# EAGLE design mini-v1.9 (EAGLE 7.2.0)

## Sheet 1 of 4: Main Microcontroller
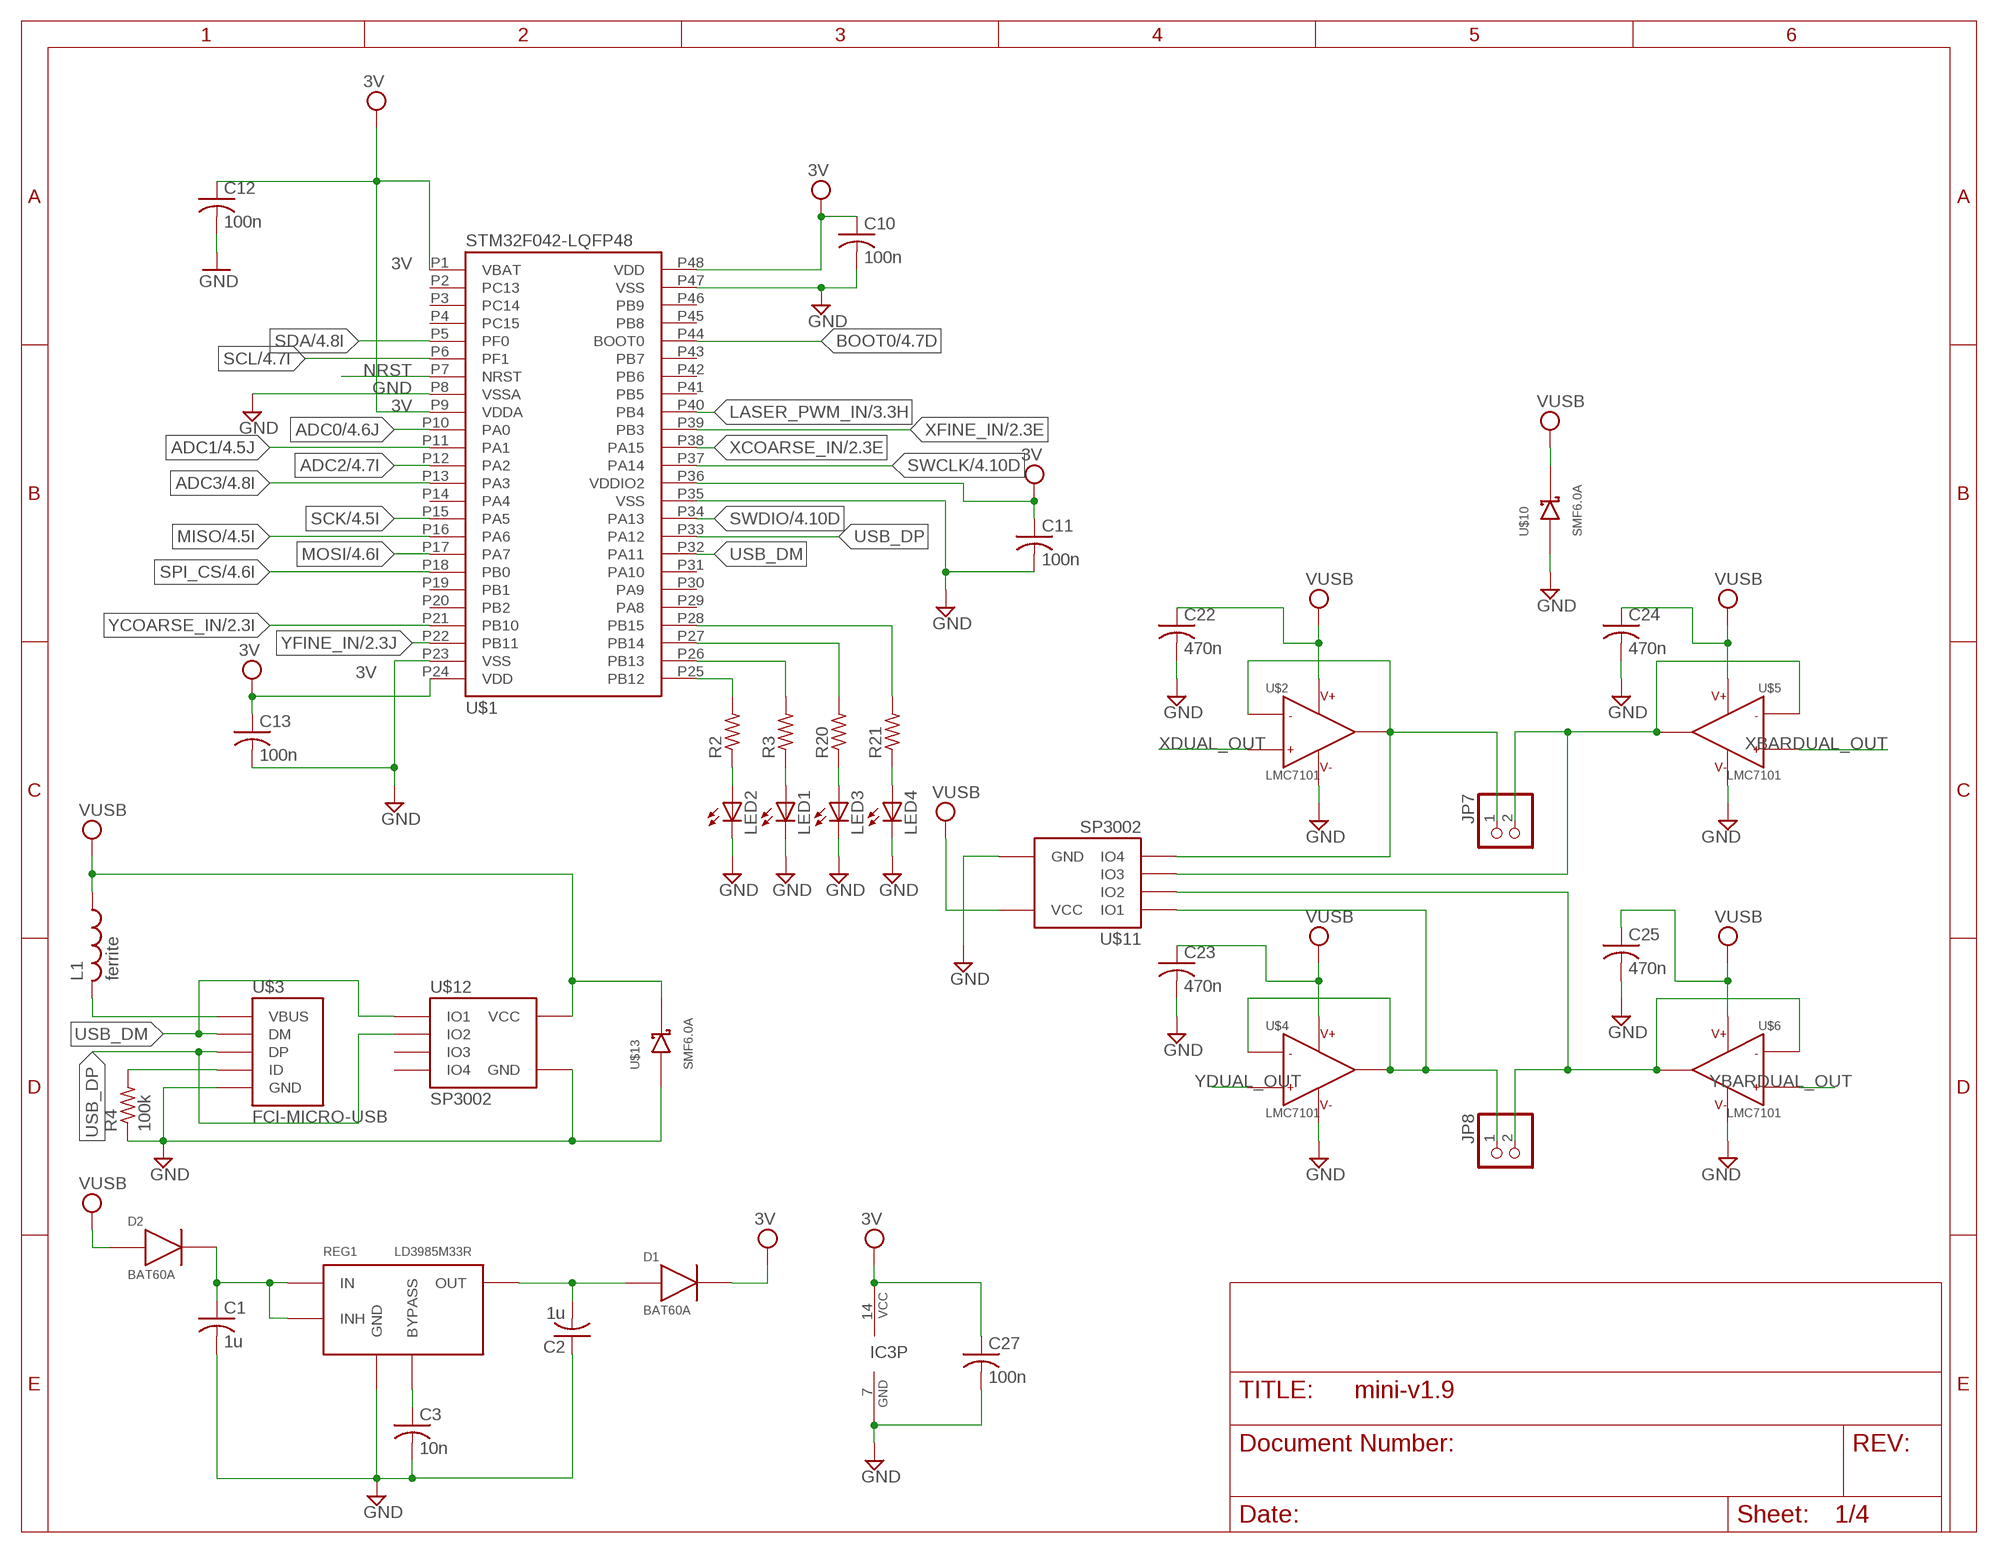
[diagram p0: schematic, sheet 1]

### Parts
C1  1u  C-USC0603  [C0603]
C2  1u  C-USC0603  [C0603]
C3  10n  C-USC0603  [C0603]
C10  100n  C-USC0603  [C0603]
C11  100n  C-USC0603  [C0603]
C12  100n  C-USC0603  [C0603]
C13  100n  C-USC0603  [C0603]
C22  470n  C-USC0603  [C0603]
C23  470n  C-USC0603  [C0603]
C24  470n  C-USC0603  [C0603]
C25  470n  C-USC0603  [C0603]
C27  100n  C-USC0603  [C0603]
D1  BAT60A  [SOD323]
D2  BAT60A  [SOD323]
IC3  74S04D  [SO14]
JP7  PINHD-1X2  [1X02]
JP8  PINHD-1X2  [1X02]
L1  ferrite  L-US  [C0603]
LED1  LEDCHIP-LED0603  [CHIP-LED0603]
LED2  LEDCHIP-LED0603  [CHIP-LED0603]
LED3  LEDCHIP-LED0603  [CHIP-LED0603]
LED4  LEDCHIP-LED0603  [CHIP-LED0603]
R2  R-US_R0603  [R0603]
R3  R-US_R0603  [R0603]
R4  100k  R-US_R0603  [R0603]
R20  R-US_R0603  [R0603]
R21  R-US_R0603  [R0603]
REG1  LD3985M33R  LD3985MXXR  [SOT23-5L]
U$1  STM32F042-LQFP48  [LQFP48]
U$2  LMC7101  [SOT23-5]
U$3  FCI-MICRO-USB  [FCI-MICROUSB]
U$4  LMC7101  [SOT23-5]
U$5  LMC7101  [SOT23-5]
U$6  LMC7101  [SOT23-5]
U$10  SMF6.0A  MBR0520  [SOD123]
U$11  SP3002  [SC70-6]
U$12  SP3002  [SC70-6]
U$13  SMF6.0A  MBR0520  [SOD123]

### Nets
3V: C10.1 C11.1 C12.1 C13.1 C27.1 D1.1 IC3.14(P:VCC) U$1.P1(VBAT) U$1.P9(VDDA) U$1.P24(VDD) U$1.P36(VDDIO2) U$1.P48(VDD) ; also sheet 2,4
3V3: C2.2 D1.2 REG1.OUT
ADC0: U$1.P10(PA0) ; also sheet 4
ADC1: U$1.P11(PA1) ; also sheet 4
ADC2: U$1.P12(PA2) ; also sheet 4
ADC3: U$1.P13(PA3) ; also sheet 4
BOOT0: U$1.P44(BOOT0) ; also sheet 4
GND [Power]: C1.2 C2.1 C3.2 C10.2 C11.2 C12.2 C13.2 C22.2 C23.2 C24.2 C25.2 C27.2 IC3.7(P:GND) LED1.C LED2.C LED3.C LED4.C R4.1 REG1.GND U$1.P8(VSSA) U$1.P23(VSS) U$1.P35(VSS) U$1.P47(VSS) U$2.5 U$3.P5(GND) U$4.5 U$5.5 U$6.5 U$10.ANODE U$11.P2(GND) U$12.P2(GND) U$13.ANODE ; also sheet 2,3,4
LASER_PWM_IN: U$1.P40(PB4) ; also sheet 3
MISO: U$1.P16(PA6) ; also sheet 4
MOSI: U$1.P17(PA7) ; also sheet 4
N$1: C3.1 REG1.BYPASS
N$2: R2.2 U$1.P25(PB12)
N$3: LED2.A R2.1
N$4: C1.1 D2.1 REG1.IN REG1.INHIBIT(INH)
N$5: R4.2 U$3.P4(ID)
N$7: JP7.1 U$2.1 U$2.4 U$11.P6(IO4)
N$9: JP8.1 U$4.1 U$4.4 U$11.P1(IO1)
N$12: LED1.A R3.1
N$13: R3.2 U$1.P26(PB13)
N$14: L1.2 U$3.P1(VBUS)
N$16: JP7.2 U$5.1 U$5.4 U$11.P4(IO3)
N$17: JP8.2 U$6.1 U$6.4 U$11.P3(IO2)
N$24: LED3.A R20.1
N$27: LED4.A R21.1
N$28: R20.2 U$1.P27(PB14)
N$29: R21.2 U$1.P28(PB15)
NRST: U$1.P7(NRST) ; also sheet 4
SCK: U$1.P15(PA5) ; also sheet 4
SCL: U$1.P6(PF1) ; also sheet 4
SDA: U$1.P5(PF0) ; also sheet 4
SPI_CS: U$1.P18(PB0) ; also sheet 4
SWCLK: U$1.P37(PA14) ; also sheet 4
SWDIO: U$1.P34(PA13) ; also sheet 4
USB_DM: U$1.P32(PA11) U$3.P2(DM) U$12.P1(IO1)
USB_DP: U$1.P33(PA12) U$3.P3(DP) U$12.P3(IO2)
VUSB [Power]: C22.1 C23.1 C24.1 C25.1 D2.2 L1.1 U$2.2 U$4.2 U$5.2 U$6.2 U$10.CATHODE U$11.P5(VCC) U$12.P5(VCC) U$13.CATHODE ; also sheet 3
XBARDUAL_OUT: U$5.3 ; also sheet 2
XCOARSE_IN: U$1.P38(PA15) ; also sheet 2
XDUAL_OUT: U$2.3 ; also sheet 2
XFINE_IN: U$1.P39(PB3) ; also sheet 2
YBARDUAL_OUT: U$6.3 ; also sheet 2
YCOARSE_IN: U$1.P21(PB10) ; also sheet 2
YDUAL_OUT: U$4.3 ; also sheet 2
YFINE_IN: U$1.P22(PB11) ; also sheet 2
Unconnected: U$1.P2(PC13) U$1.P3(PC14) U$1.P4(PC15) U$1.P14(PA4) U$1.P19(PB1) U$1.P20(PB2) U$1.P29(PA8) U$1.P30(PA9) U$1.P31(PA10) U$1.P41(PB5) U$1.P42(PB6) U$1.P43(PB7) U$1.P45(PB8) U$1.P46(PB9) U$12.P4(IO3) U$12.P6(IO4)

## Sheet 2 of 4: Dual PWM
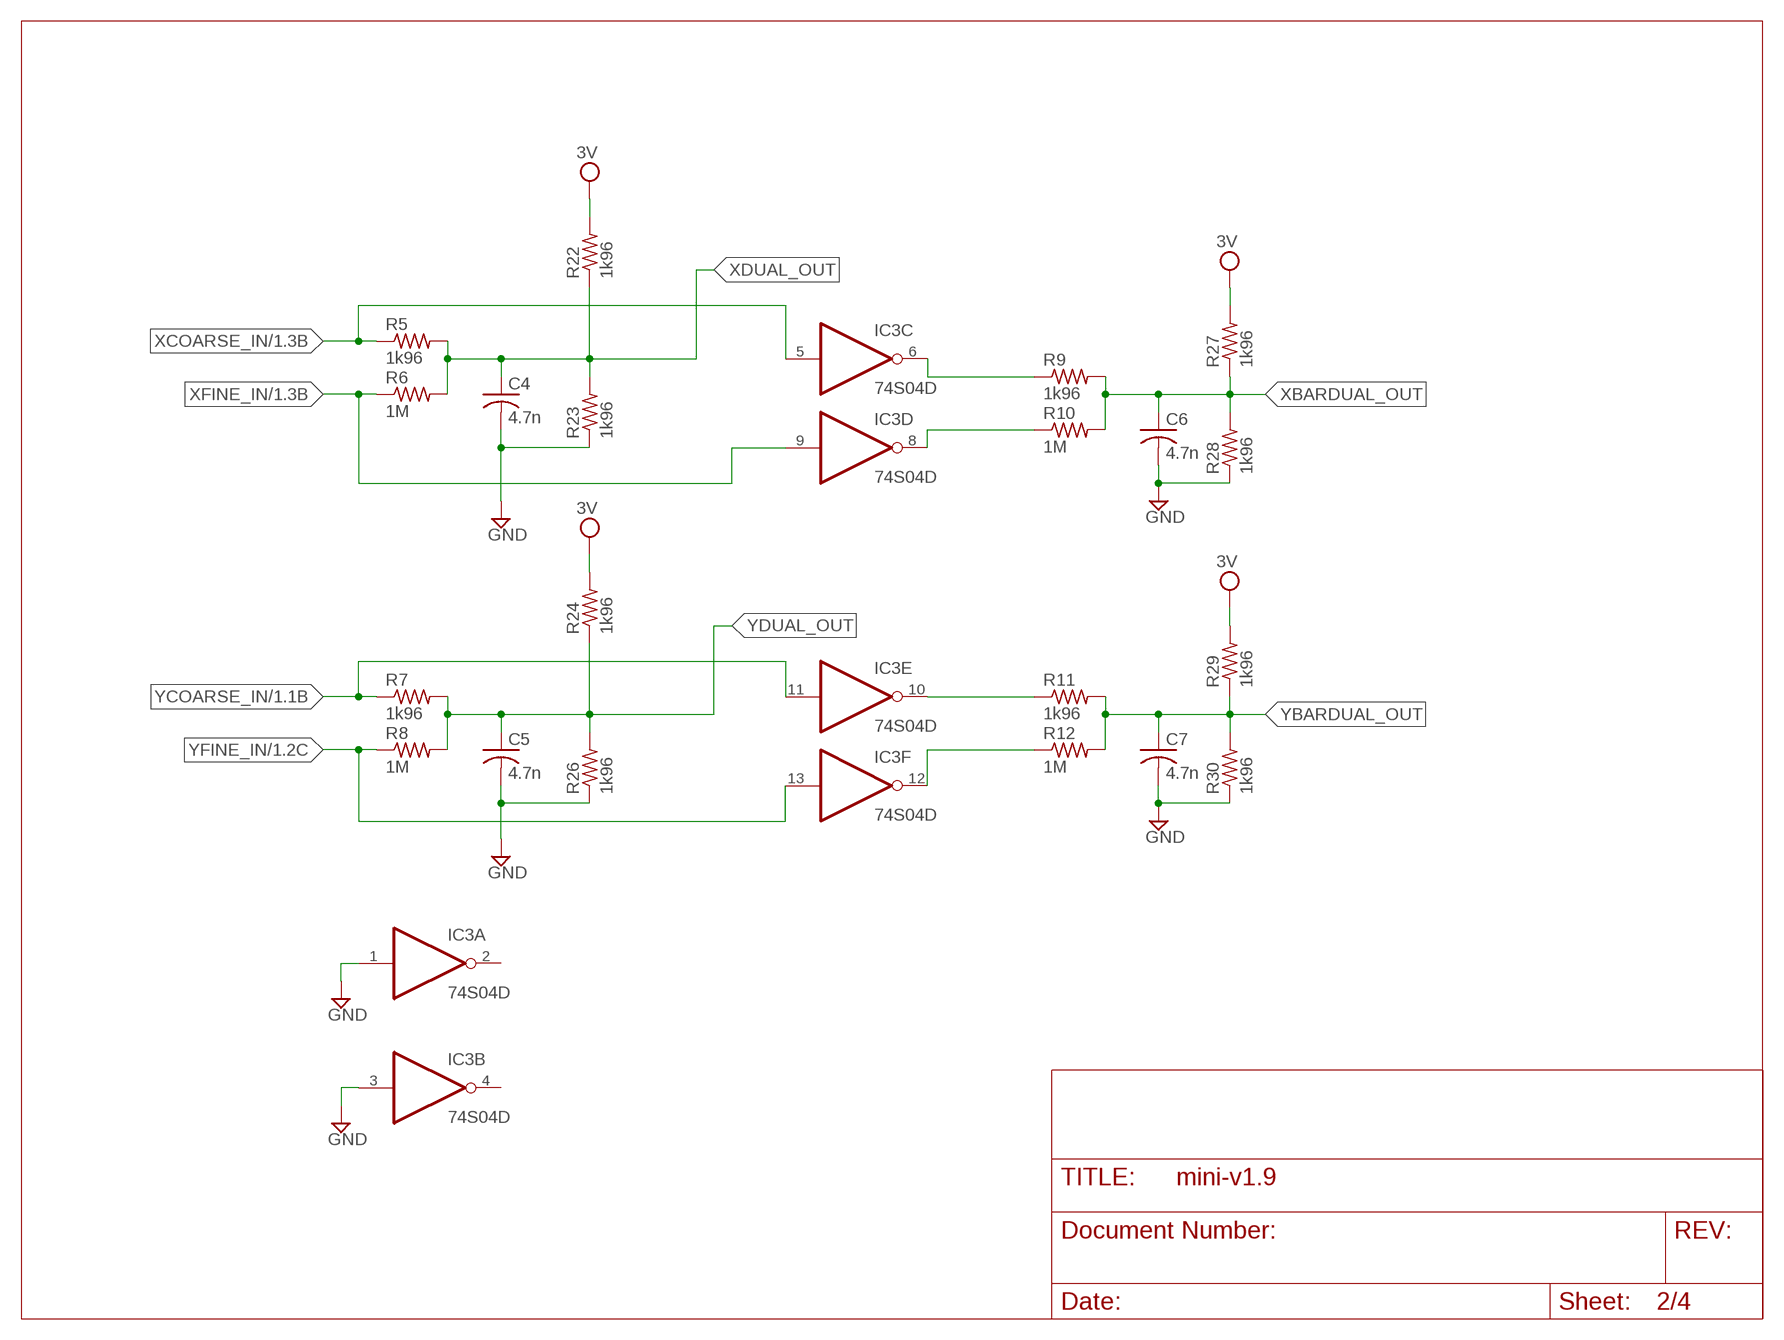
[diagram p1: schematic, sheet 2]

### Parts
C4  4.7n  C-USC0603  [C0603]
C5  4.7n  C-USC0603  [C0603]
C6  4.7n  C-USC0603  [C0603]
C7  4.7n  C-USC0603  [C0603]
R5  1k96  R-US_R0603  [R0603]
R6  1M  R-US_R0603  [R0603]
R7  1k96  R-US_R0603  [R0603]
R8  1M  R-US_R0603  [R0603]
R9  1k96  R-US_R0603  [R0603]
R10  1M  R-US_R0603  [R0603]
R11  1k96  R-US_R0603  [R0603]
R12  1M  R-US_R0603  [R0603]
R22  1k96  R-US_R0603  [R0603]
R23  1k96  R-US_R0603  [R0603]
R24  1k96  R-US_R0603  [R0603]
R26  1k96  R-US_R0603  [R0603]
R27  1k96  R-US_R0603  [R0603]
R28  1k96  R-US_R0603  [R0603]
R29  1k96  R-US_R0603  [R0603]
R30  1k96  R-US_R0603  [R0603]

### Nets
3V: R22.2 R24.2 R27.2 R29.2 ; also sheet 1,4
GND [Power]: C4.2 C5.2 C6.2 C7.2 IC3.1(A:I) IC3.3(B:I) R23.1 R26.1 R28.1 R30.1 ; also sheet 1,3,4
N$6: IC3.10(E:O) R11.1
N$8: IC3.12(F:O) R12.1
N$10: IC3.8(D:O) R10.1
N$11: IC3.6(C:O) R9.1
XBARDUAL_OUT: C6.1 R9.2 R10.2 R27.1 R28.2 ; also sheet 1
XCOARSE_IN: IC3.5(C:I) R5.1 ; also sheet 1
XDUAL_OUT: C4.1 R5.2 R6.2 R22.1 R23.2 ; also sheet 1
XFINE_IN: IC3.9(D:I) R6.1 ; also sheet 1
YBARDUAL_OUT: C7.1 R11.2 R12.2 R29.1 R30.2 ; also sheet 1
YCOARSE_IN: IC3.11(E:I) R7.1 ; also sheet 1
YDUAL_OUT: C5.1 R7.2 R8.2 R24.1 R26.2 ; also sheet 1
YFINE_IN: IC3.13(F:I) R8.1 ; also sheet 1
Unconnected: IC3.2(A:O) IC3.4(B:O)

## Sheet 3 of 4: Laser Power Driver
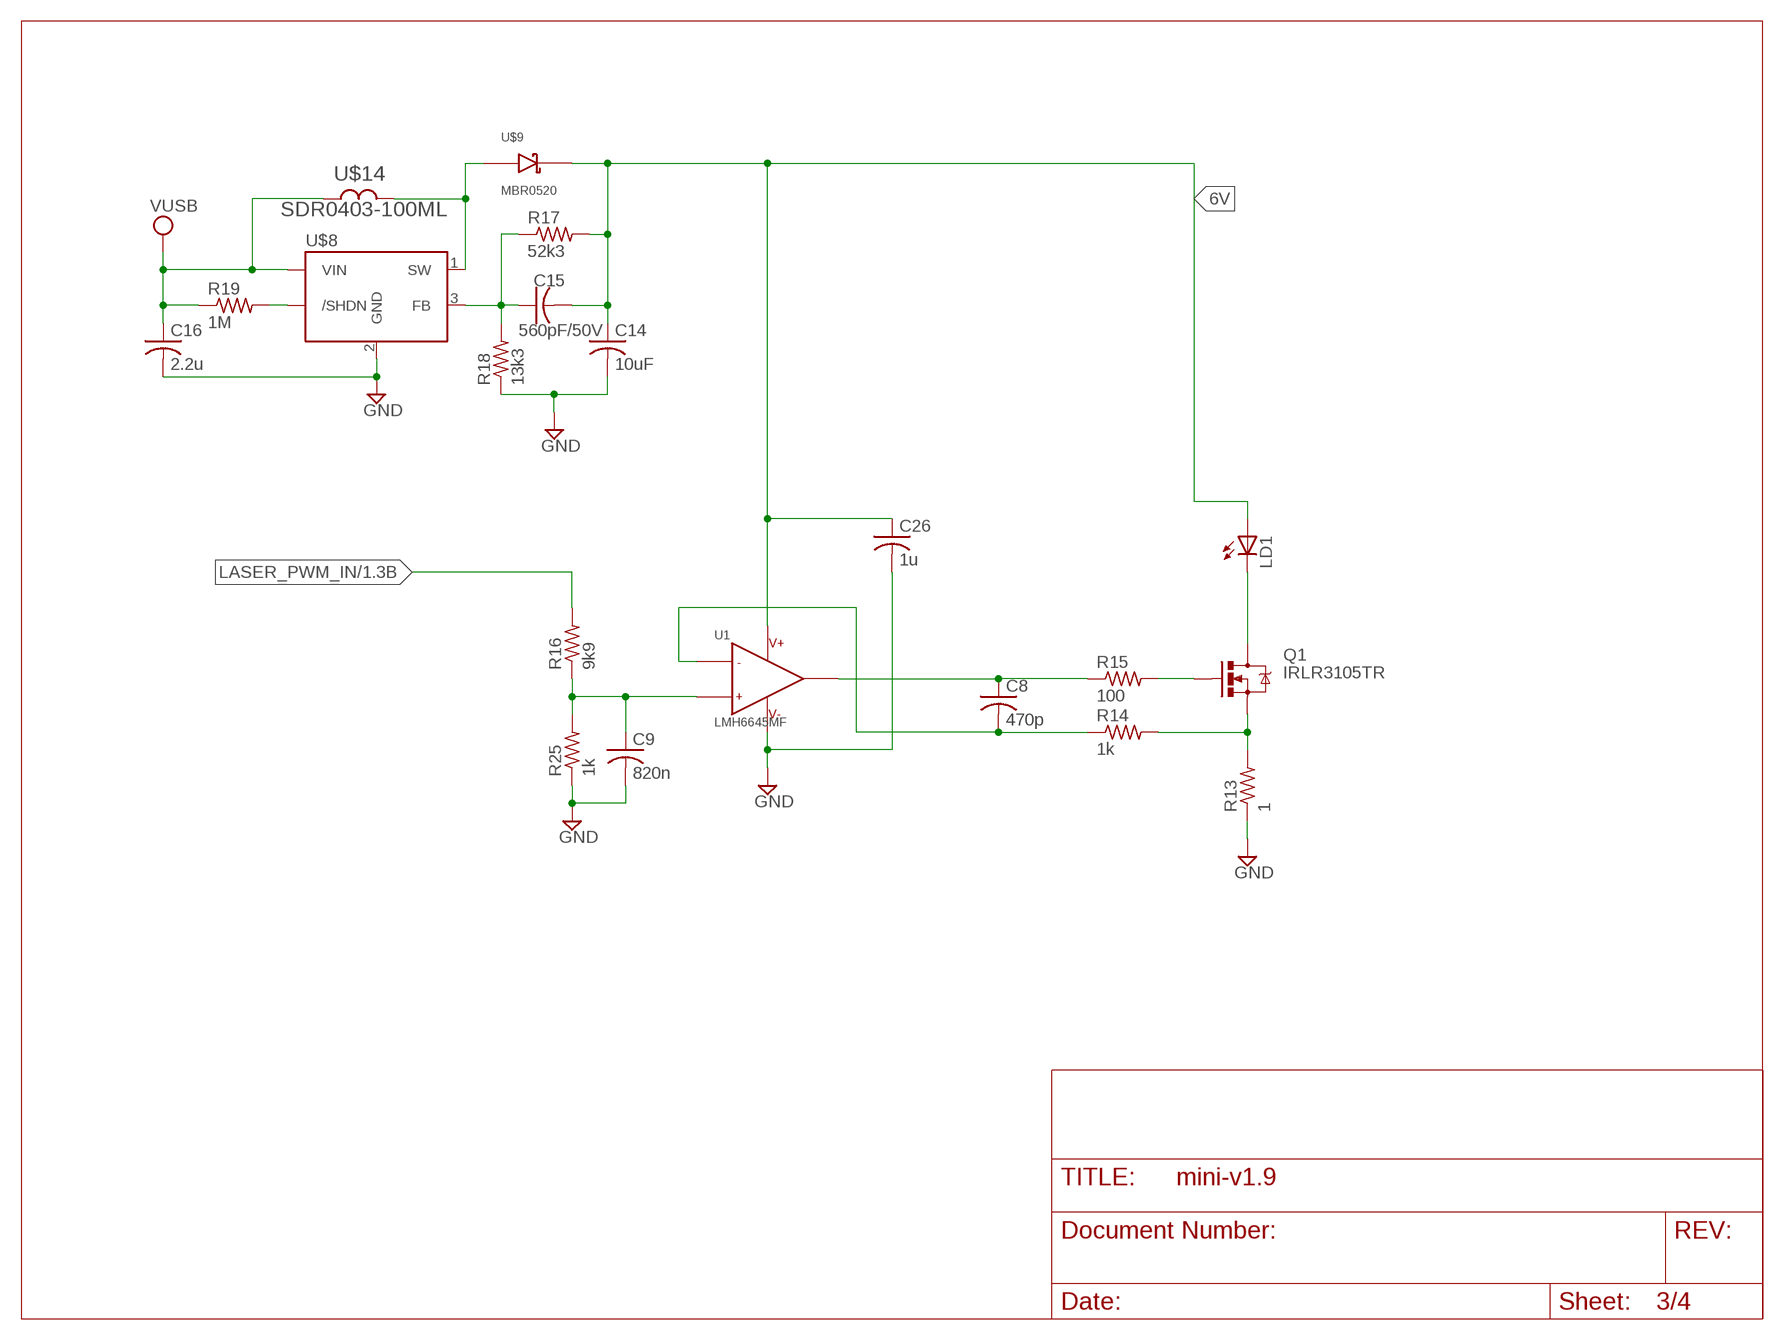
[diagram p2: schematic, sheet 3]

### Parts
C8  470p  C-USC0603  [C0603]
C9  820n  C-USC0603  [C0603]
C14  10uF  C-USC0603  [C0603]
C15  560pF/50V  C-USC0603  [C0603]
C16  2.2u  C-USC0603  [C0603]
C26  1u  C-USC0603  [C0603]
LD1  LASERDIODELD2  [LASERDIODE2]
Q1  IRLR3105TR  FET-N-IRLR3105TRIRLR3105TR  [DPAK]
R13  1  R-US_R0603  [R0603]
R14  1k  R-US_R0603  [R0603]
R15  100  R-US_R0603  [R0603]
R16  9k9  R-US_R0603  [R0603]
R17  52k3  R-US_R0603  [R0603]
R18  13k3  R-US_R0603  [R0603]
R19  1M  R-US_R0603  [R0603]
R25  1k  R-US_R0603  [R0603]
U1  LMH6645MF  OPAMP-SINGLELMH6645MF  [SOT23-5]
U$8  LMR62014  [SOT23-5]
U$9  MBR0520  [SOD123]
U$14  SDR0403-100ML  SDR0403  [SDR0403]

### Nets
6V [Power]: C14.1 C15.2 C26.1 LD1.P$1(A) R17.2 U1.5(V+) U$9.CATHODE
GND [Power]: C9.2 C14.2 C16.2 C26.2 R13.1 R18.1 R25.1 U1.2(V-) U$8.2(GND) ; also sheet 1,2,4
LASER_PWM_IN: R16.2 ; also sheet 1
N$15: U$8.1(SW) U$9.ANODE U$14.P$2
N$18: LD1.P$3(C) Q1.4(D)
N$19: Q1.3(S) R13.2 R14.2
N$20: C8.2 R14.1 U1.4(IN-)
N$21: Q1.1(G) R15.2
N$22: C8.1 R15.1 U1.1(OUT)
N$23: C9.1 R16.1 R25.2 U1.3(IN+)
N$25: C15.1 R17.1 R18.2 U$8.3(FB)
N$26: R19.2 U$8.4(/SHDN)
VUSB [Power]: C16.1 R19.1 U$8.5(VIN) U$14.P$1 ; also sheet 1

## Sheet 4 of 4
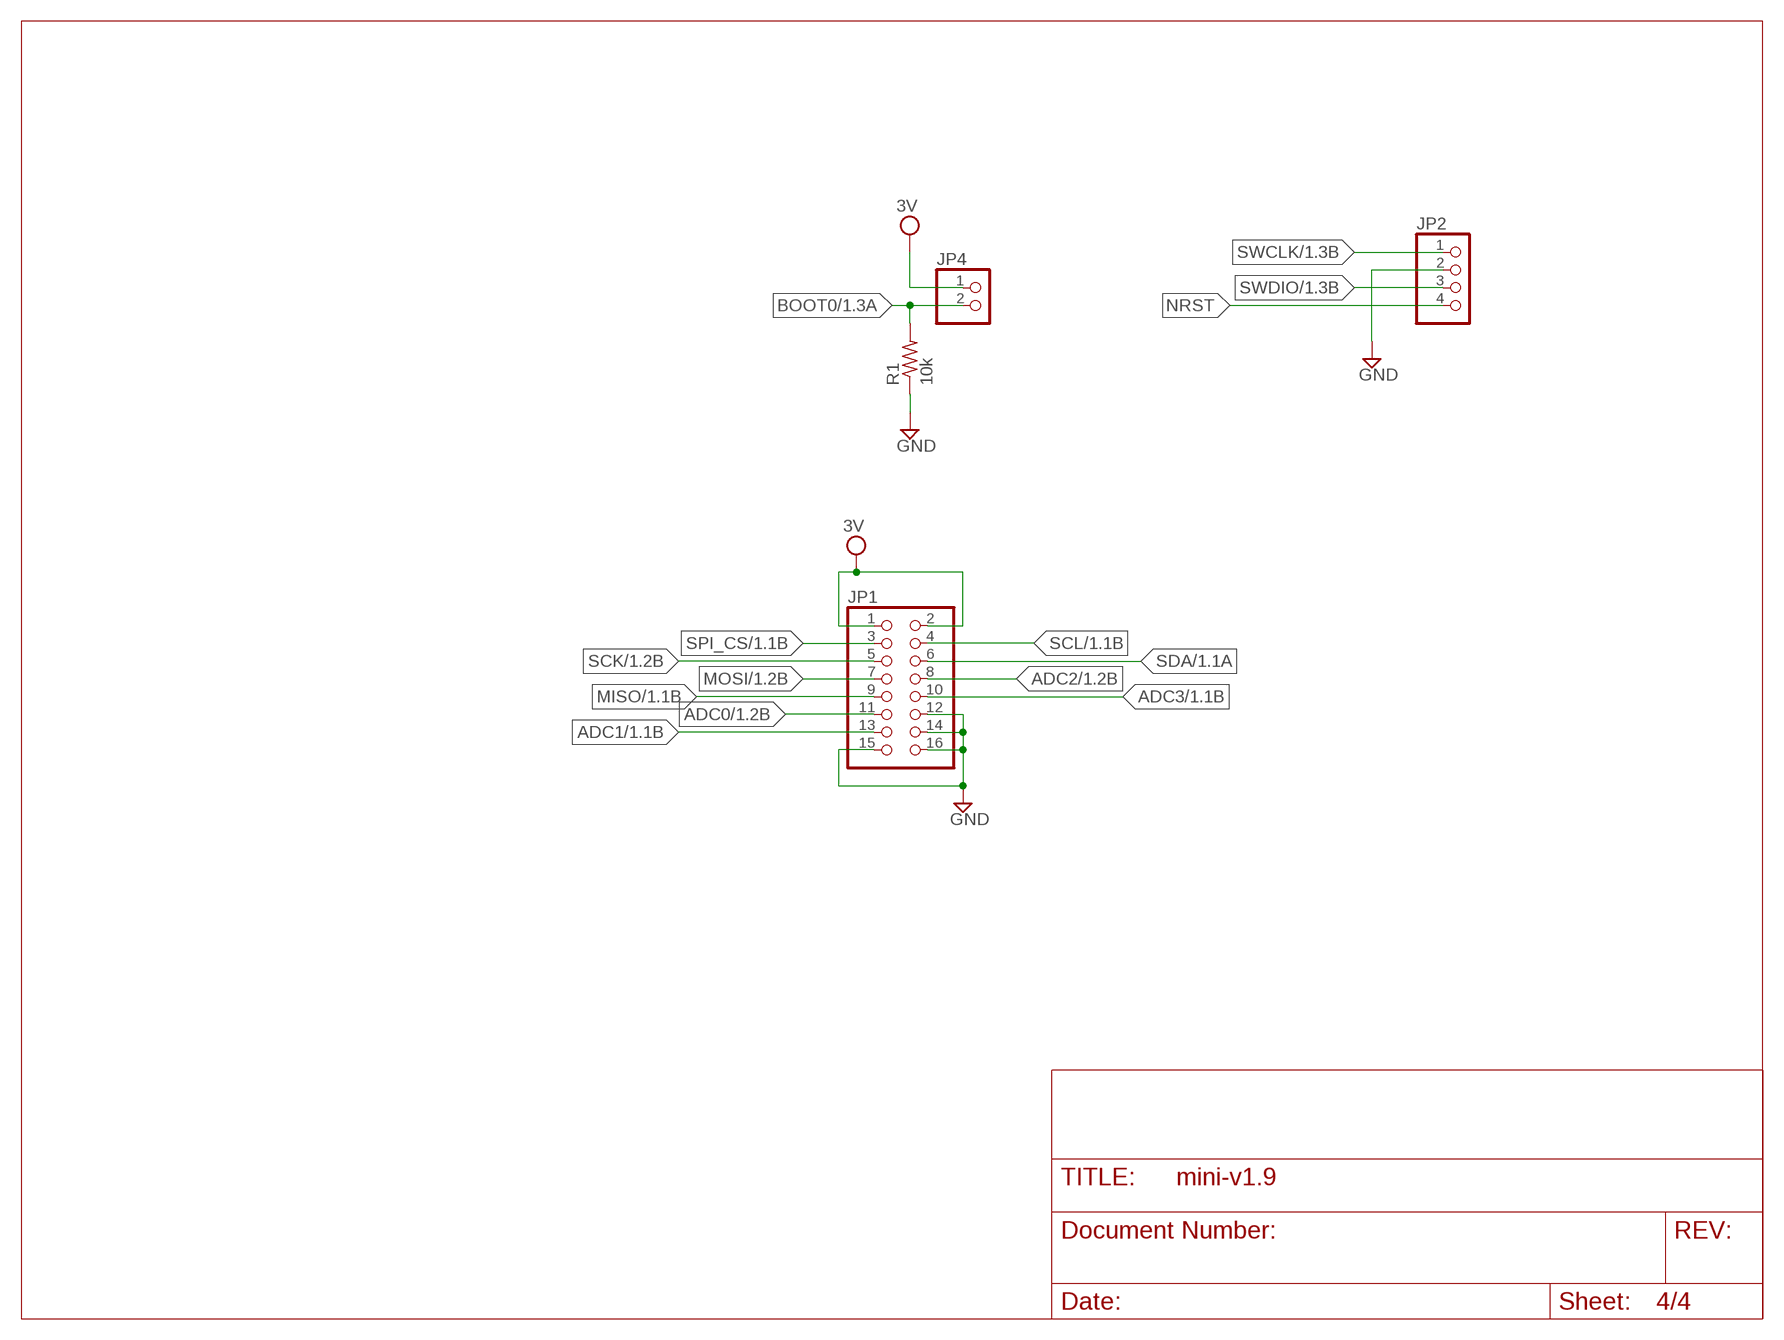
[diagram p3: schematic, sheet 4]

### Parts
JP1  PINHD-2X8  [2X08]
JP2  PINHD-1X4  [1X04]
JP4  PINHD-1X2  [1X02]
R1  10k  R-US_R0603  [R0603]

### Nets
3V: JP1.1 JP1.2 JP4.1 ; also sheet 1,2
ADC0: JP1.11 ; also sheet 1
ADC1: JP1.13 ; also sheet 1
ADC2: JP1.8 ; also sheet 1
ADC3: JP1.10 ; also sheet 1
BOOT0: JP4.2 R1.2 ; also sheet 1
GND [Power]: JP1.12 JP1.14 JP1.15 JP1.16 JP2.2 R1.1 ; also sheet 1,2,3
MISO: JP1.9 ; also sheet 1
MOSI: JP1.7 ; also sheet 1
NRST: JP2.4 ; also sheet 1
SCK: JP1.5 ; also sheet 1
SCL: JP1.4 ; also sheet 1
SDA: JP1.6 ; also sheet 1
SPI_CS: JP1.3 ; also sheet 1
SWCLK: JP2.1 ; also sheet 1
SWDIO: JP2.3 ; also sheet 1

## Library data of the parts
C1-C16 C22-C27 = rcl:C-US: CAPACITOR, American symbol
D1 D2 = lmdparts:BAT60A
IC3 = lmdparts:74*04: Hex INVERTER
JP1 = pinhead:PINHD-2X8: PIN HEADER
JP2 = pinhead:PINHD-1X4: PIN HEADER
JP4 JP7 JP8 = pinhead:PINHD-1X2: PIN HEADER
L1 = lmdparts:L-US: INDUCTOR, American symbol
LD1 = Scott:LASERDIODE; MPN: 3 x (0552-2-15-15-11-27-10-0)
LED1-LED4 = adafruit:LED: LED OSRAM: - CHIPLED LG R971, LG N971, LY N971, LG Q971, LY Q971, LO R971, LY R971 LH N974, LH R974 LS Q976, LO Q976, LY Q976 LO Q996 - Hyper CHIPLED LW Q18S LB Q993, LB Q99A, LB R99A - SideLED LS A670, LO A670, LY A670, LG A670, LP A670 LB A673, LV A673, LT A673, LW A673 LH A674 LY A675 LS A676, LA A676, LO A676, LY A676, LW A676 LS A679, LY A679, LG A679 - Hyper Micro SIDELED® LS Y876, LA Y876, LO Y876, LY Y876 LT Y87S - SmartLED LW L88C, LW L88S LB L89C, LB L89S, LG L890 LS L89K, LO L89K, LY L89K LS L896, LA L896, LO L896, LY L896 - TOPLED LS T670, LO T670, LY T670, LG T670, LP T670 LSG T670, LSP T670, LSY T670, LOP T670, LYG T670 LG T671, LOG T671, LSG T671 LB T673, LV T673, LT T673, LW T673 LH T674 LS T676, LA T676, LO T676, LY T676, LB T676, LH T676, LSB T676, LW T676 LB T67C, LV T67C, LT T67C, LS T67K, LO T67K, LY T67K, LW E67C LS E67B, LA E67B, LO E67B, LY E67B, LB E67C, LV E67C, LT E67C LW T67C LS T679, LY T679, LG T679 LS T770, LO T770, LY T770, LG T770, LP T770 LB T773, LV T773, LT T773, LW T773 LH T774 LS E675, LA E675, LY E675, LS T675 LS T776, LA T776, LO T776, LY T776, LB T776 LHGB T686 LT T68C, LB T68C - Hyper Mini TOPLED® LB M676 - Mini TOPLED Santana® LG M470 LS M47K, LO M47K, LY M47K Source: http://www.osram.convergy.de/
Q1 = lmdparts:FET-N-IRLR3105TR: Common NMOSFET Parts MFG P/N Store ID Prod ID FDD8780 TRANS-09984 SI7820DN TRANS-11055 FDS6630A IC-08089 2N7002PW TRANS-11151 FQP30N06L COM-10213 TRANS-10060 BSS123LT1G TRANS-08345 BSS138 TRANS-00830 BS170 2N7000; PROD_ID: TRANS-09984
R1-R30 = rcl:R-US_: RESISTOR, American symbol
REG1 = lmdparts:LD3985MXXR
U1 = lmdparts:OPAMP-SINGLE: Single amp opamps
U$1 = lmdparts:STM32F042-LQFP48
U$2 U$4-U$6 = lmdparts:LMC7101
U$3 = lmdparts:FCI-MICRO-USB
U$8 = lmdparts:LMR62014
U$9 U$10 U$13 = lmdparts:MBR0520
U$11 U$12 = lmdparts:SP3002
U$14 = lmdparts:SDR0403

## Net classes
1 Power: width 0.305 mm

## Board
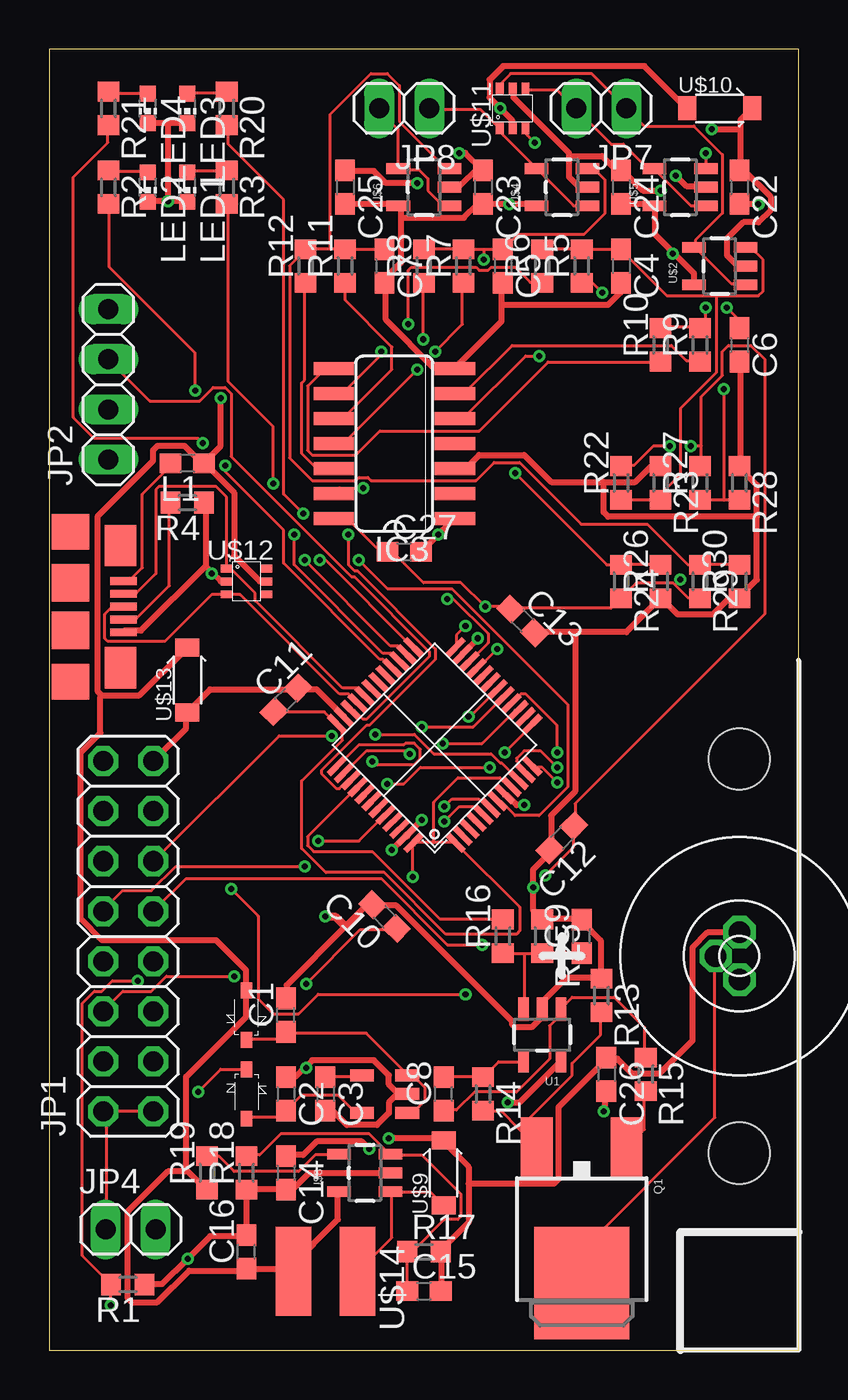
[diagram p4: board, top side]
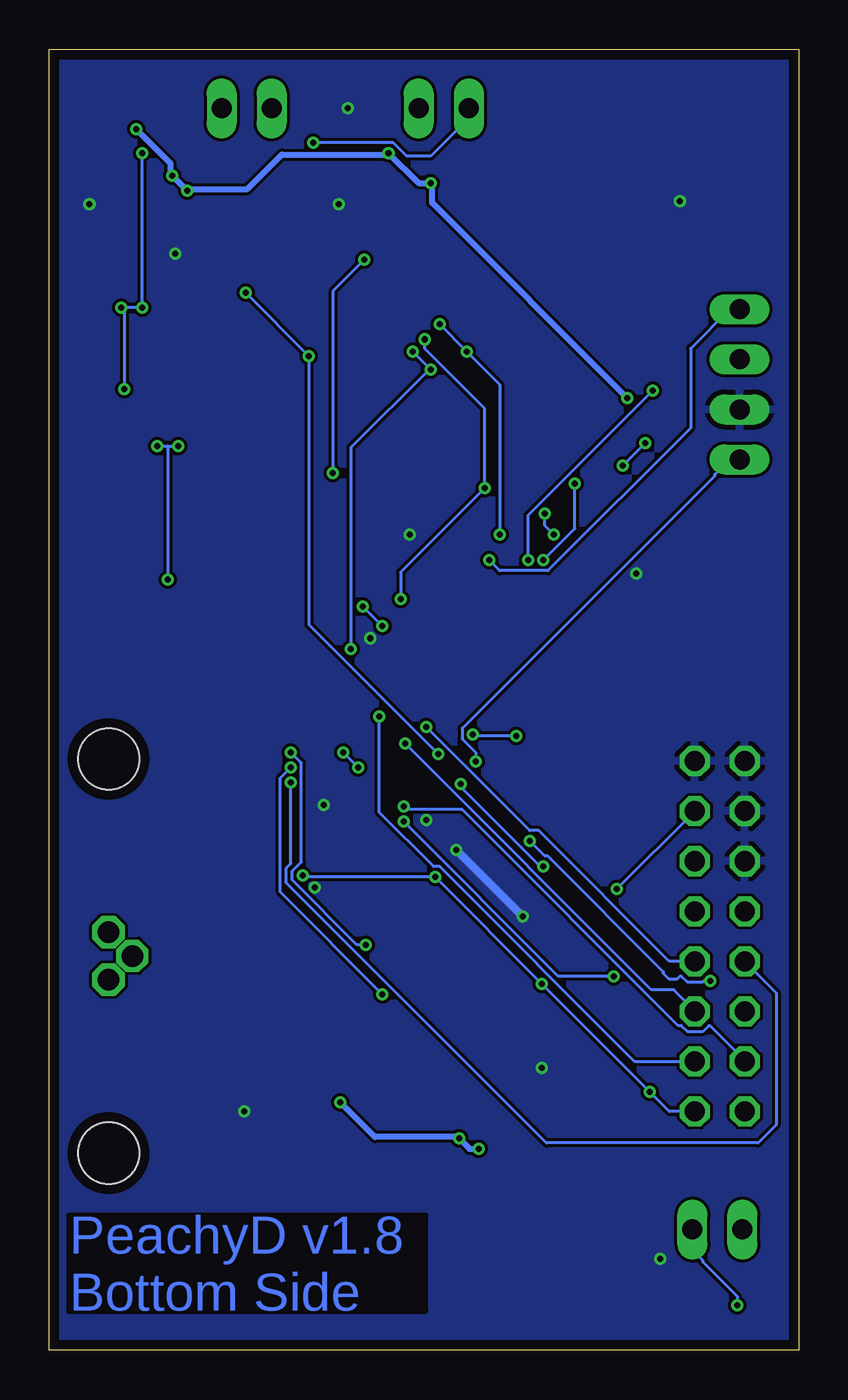
[diagram p5: board, bottom side, seen from below]

Size 38.01 x 66 mm. Coordinates in mm from the lower left corner, seen from the top.
Outline: 0,0 38.01,0 38,66 0,66 0,0
Copper layers (1*16): Top 0.035mm / dielectric 1.5mm / Bottom 0.035mm
Design rules "SeeedStudio_2layer_DRU_no_angle_20140221 *": minimum track width 6mil, minimum drill 12mil, track to track 6mil, track to pad 6mil, pad to pad 6mil, via to via 6mil, smd to smd 0mil, copper to edge 20mil, drill to drill 10mil, minimum pad ring 10mil, minimum via ring 6mil, stop-mask expansion 2mil, vias tented up to drill 100mil, thermal gap 10mil
Holes 3.1 mm at 35,10 35,30

### Footprints (pad centres in the part's own frame; a part is rotated, then mirrored left to right if it is on the bottom)
C0603 = smd 1.1 x 1: 1 -0.85,0; 2 0.85,0
SOD323 = smd 0.6 x 0.8: 1 0,1.25; 2 0,-1.25
SO14 = smd 0.66 x 2.032: 1 -3.81,-3.073; 2 -2.54,-3.073; 3 -1.27,-3.073; 4 0,-3.073; 5 1.27,-3.073; 6 2.54,-3.073; 7 3.81,-3.073; 8 3.81,3.073; 9 2.54,3.073; 10 1.27,3.073; 11 0,3.073; 12 -1.27,3.073; 13 -2.54,3.073; 14 -3.81,3.073
2X08 = drill 1.016 octagon: 1 -8.89,-1.27; 2 -8.89,1.27; 3 -6.35,-1.27; 4 -6.35,1.27; 5 -3.81,-1.27; 6 -3.81,1.27; 7 -1.27,-1.27; 8 -1.27,1.27; 9 1.27,-1.27; 10 1.27,1.27; 11 3.81,-1.27; 12 3.81,1.27; 13 6.35,-1.27; 14 6.35,1.27; 15 8.89,-1.27; 16 8.89,1.27
1X04 = drill 1.016 long: 1 -3.81,0; 2 -1.27,0; 3 1.27,0; 4 3.81,0
1X02 = drill 1.016 long: 1 -1.27,0; 2 1.27,0
LASERDIODE2 = drill 1.092 pad 1.499 octagon: P$1 0,1.203; P$2 0,-1.203; P$3 -1.203,0
CHIP-LED0603 = smd 0.8 x 0.8: A 0,-0.75; C 0,0.75
DPAK = smd 1.6 x 3: 1 -2.28,-5.31; 3 2.28,-5.31 | smd 4.826 x 5.715: 4 0,1.588
R0603 = smd 1 x 1.1: 1 -0.85,0; 2 0.85,0
SOT23-5L = smd 0.6 x 1.2: BYPASS -0.95,-1.15; GND 0,1.15; IN 0.95,1.15; INHIBIT -0.95,1.15; OUT 0.95,-1.15
SOT23-5 = smd 0.55 x 1.2: 1 -0.95,-1.3; 2 0,-1.3; 3 0.95,-1.3; 4 0.95,1.3; 5 -0.95,1.3
LQFP48 = smd 0.3 x 1.2: P1 -2.75,-0.6; P2 -2.25,-0.6; P3 -1.75,-0.6; P4 -1.25,-0.6; P5 -0.75,-0.6; P6 -0.25,-0.6; P7 0.25,-0.6; P8 0.75,-0.6; P9 1.25,-0.6; P10 1.75,-0.6; P11 2.25,-0.6; P12 2.75,-0.6; P25 2.75,7.9; P26 2.25,7.9; P27 1.75,7.9; P28 1.25,7.9; P29 0.75,7.9; P30 0.25,7.9; P31 -0.25,7.9; P32 -0.75,7.9; P33 -1.25,7.9; P34 -1.75,7.9; P35 -2.25,7.9; P36 -2.75,7.9 | smd 1.2 x 0.3: P13 4.25,0.9; P14 4.25,1.4; P15 4.25,1.9; P16 4.25,2.4; P17 4.25,2.9; P18 4.25,3.4; P19 4.25,3.9; P20 4.25,4.4; P21 4.25,4.9; P22 4.25,5.4; P23 4.25,5.9; P24 4.25,6.4; P37 -4.25,6.4; P38 -4.25,5.9; P39 -4.25,5.4; P40 -4.25,4.9; P41 -4.25,4.4; P42 -4.25,3.9; P43 -4.25,3.4; P44 -4.25,2.9; P45 -4.25,2.4; P46 -4.25,1.9; P47 -4.25,1.4; P48 -4.25,0.9
FCI-MICROUSB = smd 0.4 x 1.35: P1 -1.3,2.7; P2 -0.65,2.7; P3 0,2.7; P4 0.65,2.7; P5 1.3,2.7 | smd 1.8 x 1.9: P$1 3.8,0; P$2 -3.8,0 | smd 1.9 x 1.9: P$3 -1.2,0; P$4 1.2,0 | smd 2.1 x 1.6: P$5 -3.1,2.55; P$6 3.1,2.55
SOD123 = smd 0.91 x 1.22: ANODE -1.65,0; CATHODE 1.65,0
SC70-6 = smd 0.4 x 0.6: P1 -0.65,-1; P2 0,-1; P3 0.65,-1; P4 0.65,1; P5 0,1; P6 -0.65,1
SDR0403 = smd 4.5 x 1.8: P$1 0,1.625; P$2 0,-1.625

### Placement (x,y rotation side)
C1  12,17 90 top
C2  12,13 270 top
C3  14,13 270 top
C4  29,55 270 top
C5  23,55 270 top
C6  35,51 270 top
C7  17,55 270 top
C8  20,13 90 top
C9  27,21 90 top
C10  17,22 135 top
C11  12,33 45 top
C12  26,26 225 top
C13  24,37 315 top
C14  12,9 270 top
C15  19,3 0 top
C16  10,5 90 top
C22  35,59 270 top
C23  22,59 270 top
C24  29,59 270 top
C25  15,59 270 top
C26  28.25,14 270 top
C27  18,40.5 0 top
D1  10,13 0 top
D2  10,17 180 top
IC3  17.5,46 90 top
JP1  4,21 90 top
JP2  3,49 90 top
JP4  4.12,6.12 0 top
JP7  28,63 180 top
JP8  18,63 180 top
L1  7,45 180 top
LD1  35,20 0 top
LED1  7,59 180 top
LED2  5,59 180 top
LED3  7,63 180 top
LED4  5,63 180 top
Q1  27,5 180 top
R1  3.98,3.34 180 top
R2  3,59 270 top
R3  9,59 270 top
R4  7,43 180 top
R5  27,55 90 top
R6  25,55 90 top
R7  21,55 90 top
R8  19,55 90 top
R9  33,51 90 top
R10  31,51 90 top
R11  15,55 90 top
R12  13,55 90 top
R13  28,18 270 top
R14  22,13 270 top
R15  30.25,14 270 top
R16  23,21 90 top
R17  19,5 0 top
R18  10,9 90 top
R19  8,9 90 top
R20  9,63 270 top
R21  3,63 270 top
R22  29,44 90 top
R23  31,44 270 top
R24  29,39 270 top
R25  25,21 270 top
R26  31,39 90 top
R27  33,44 90 top
R28  35,44 270 top
R29  33,39 270 top
R30  35,39 90 top
REG1  17,13 270 top
U1  25,16 180 top
U$1  22.12,28.12 45 top
U$2  34,55 90 top
U$3  1.07,37.73 270 top
U$4  26,59 90 top
U$5  32,59 90 top
U$6  19,59 90 top
U$8  16,9 90 top
U$9  20,9 90 top
U$10  34,63 0 top
U$11  23.5,63 0 top
U$12  10,39 270 top
U$13  7,34 90 top
U$14  14,4 90 top

### Tracks (layer width: path | path; a pad name or v marks a point on that pad's centre or on a via)
3V  (via drill 0.3)
  Top 0.152: IC3.14 14.48,42.14 15.16,42.14 16.76,40.54 17.14,40.54 C27.1 17.22,40.46 17.45,40.46 18.97,38.94 20.88,38.94 v22.1,37.72 23.47,37.72 C13.1 23.47,37.64 28.5,37.64 28.96,38.1 R24.2 29.03,38.18 29.79,38.94 31.62,38.94 31.74,38.82 | 31.74,38.82 32.38,38.18 32.99,38.18 R29.2 | v21.11,36.73 20.65,36.27 20.65,35.66 U$1.P24 | 33.07,45.87 33.07,44.88 R27.2 | 33.07,45.87 33.07,48.39 34.14,49.45 34.14,50.67 34.44,50.98 35.59,50.98 36.27,50.29 36.27,37.34 26.67,27.74 26.67,26.67 C12.1 26.59,25.53 v25.15,24.08 | v31.47,45.87 30.63,45.87 29.64,44.88 29.03,44.88 R22.2 | 33.07,45.87 v32.54,45.87 | v32,39.09 31.74,38.82 | C11.1 11.43,32.38 13.95,32.38 14.55,31.77 U$1.P36 14.63,31.7 14.86,31.47 14.86,30.94 12.8,28.88 12.8,25.45 14.02,24.23 16.99,24.23 20.12,21.11 23.7,21.11 23.85,21.26 23.85,22.48 20.65,25.68 U$1.P1 20.57,25.76 19.51,25.76 | 19.51,25.76 18.52,25.76 U$1.P48 | 19.51,25.76 19.51,27.81 20.73,29.03 22.86,29.03 23.24,28.65 23.39,28.65 U$1.P9 | v7.54,13.11 8.69,14.25 9.98,14.25 D1.1 | v13.03,18.59 15.77,21.34 17.53,21.34 C10.1 | 2.9,12.12 5.26,12.12 JP1.1 | 2.9,12.12 2.74,12.12 JP1.2 2.9,12.12 | 2.9,12.12 2.9,6.17 JP4.1 | v18.44,24 18.44,25.68
  Top 0.305: 18.44,25.68 U$1.P48
  Bottom 0.152: v22.1,37.72 v21.11,36.73 | v32.54,45.87 32,45.87 | 32,45.87 v31.47,45.87 | 32,45.87 v32,39.09 | JP1.1 5.33,12.12 6.55,12.12 v7.54,13.11 v13.03,18.59 v18.44,24 25.07,24 v25.15,24.08
3V3
  Top 0.152: D1.2 10.06,11.81 11.66,11.81 11.96,12.12 C2.2 12.04,12.19 12.8,12.95 14.63,12.95 15.47,12.12 15.85,12.12 REG1.OUT
6V  (via drill 0.3)
  Top 0.305: LD1.P$1 34.98,21.18 33.38,21.18 32.61,20.42 32.61,15.7 30.94,14.02 29.57,14.02 28.8,14.78 28.27,14.78 C26.1 28.19,14.71 25.83,12.34 25.83,8.69 25.6,8.46 21.26,8.46 | C15.2 19.89,3.05 19.89,4.95 R17.2 19.89,5.11 21.26,6.48 21.26,8.46 | v16.23,10.21 15.85,10.59 13.56,10.59 12.88,9.91 12.04,9.91 C14.1 | v17.22,10.74 19.89,10.74 19.96,10.67 U$9.CATHODE 20.04,10.52 21.26,9.3 21.26,8.46 | v23.24,12.57 23.85,12.57 25.91,14.63 U1.5
  Bottom 0.305: v16.23,10.21 16.69,10.21 v17.22,10.74 17.3,10.82 21.49,10.82 v23.24,12.57
ADC0  (via drill 0.3)
  Top 0.152: v16.54,31.24 18.52,31.24 19.51,30.25 22.4,30.25 22.86,29.79 22.94,29.79 23.77,28.96 U$1.P10 | v14.33,31.17 11.66,31.17 5.33,24.84 JP1.11
  Bottom 0.152: v16.54,31.24 16.46,31.17 v14.33,31.17
ADC1  (via drill 0.3)
  Top 0.152: v25.76,29.57 24.92,30.4 24.08,30.4 23.7,30.02 23.7,29.87 24.08,29.49 24.08,29.34 U$1.P11 | v21.11,18.06 13.64,18.06 12.65,17.07 11.35,17.07 10.59,17.83 10.59,22.02 v9.22,23.39
  Bottom 0.152: v25.76,29.57 26.29,29.03 26.29,23.24 v21.11,18.06 | v9.22,23.39 5.33,27.28 JP1.13
ADC2  (via drill 0.3)
  Top 0.152: v25.76,28.8 24.99,29.57 24.54,29.57 U$1.P12
  Bottom 0.152: v25.76,28.8 25.76,24.69 25.98,24.46 25.98,23.7 12.8,10.52 2.06,10.52 1.14,11.43 1.14,18.14 2.67,19.66 JP1.8
ADC3  (via drill 0.3)
  Top 0.152: v23.09,30.33 24.46,31.7 U$1.P13 | v22.33,29.57 18.82,29.57 17.98,28.73 v17.14,28.73 | v12.95,24.54 6.4,24.54 5.18,23.32 3.73,23.32 2.74,22.33 JP1.10
  Bottom 0.152: v22.33,29.57 v23.09,30.33 | v17.14,28.73 17.14,28.57 13.11,24.54 v12.95,24.54
BOOT0  (via drill 0.3)
  Top 0.152: v3.12,2.29 3.12,3.28 R1.2 3.12,3.35 1.68,4.8 1.68,17.6 2.29,18.21 2.67,18.21 3.2,18.75 v4.5,18.75 | v13.64,25.83 15.7,25.83 16.99,27.13 U$1.P44
  Bottom 0.152: v3.12,2.29 3.12,2.74 4.88,4.5 4.88,4.57 5.33,5.03 5.33,6.1 JP4.2 | v13.64,25.83 12.88,25.07 12.72,25.07 6.86,19.2 6.86,19.13 6.55,18.82 6.17,18.82 6.02,18.97 5.94,18.97 5.64,18.67 4.88,18.67 4.8,18.75 v4.5,18.75
GND  (via drill 0.3)
  Top 0.305: C1.2 12.04,17.91 12.04,18.52 15.01,21.49 16.08,22.55 16.38,22.55 C10.2 16.54,22.55 17.6,22.55 23.47,16.69 23.47,16.54 23.62,16.38 24.46,16.38 24.92,16.84 24.92,17.22 U1.2 25.07,17.37 25.07,17.75 26.21,18.9 27.81,18.9 R13.1 27.96,18.9 27.96,20.8 27.05,21.72 C9.2 26.98,21.87 25.07,21.87 R25.1 24.92,21.95 24.54,22.33 v24.54,23.47 24.54,24.38 25.38,25.22 25.38,25.38 C12.2 25.45,25.53 25.45,27.13 26.67,28.35 26.67,36.42 | 28.12,44.04 25.45,44.04 24.08,45.41 21.79,45.41 21.18,44.81 20.57,44.81 IC3.3 | 28.12,44.04 29.72,44.04 30.48,44.81 30.94,44.81 R23.1 | C6.2 35.05,50.14 35.05,44.88 R28.1 35.05,44.73 35.89,43.89 35.89,42.29 | 26.67,36.42 29.26,36.42 30.94,38.1 R26.1 31.09,38.1 31.85,37.34 33.68,37.34 34.44,38.1 34.98,38.1 R30.1 35.05,38.25 35.89,39.09 35.89,42.29 | 26.67,36.42 24.61,36.42 C13.2 | 28.12,44.04 28.12,42.52 28.35,42.29 35.89,42.29 | U$4.5 24.69,58.06 24.61,58.14 v23.32,58.14 22.02,58.14 C23.2 21.87,58.14 21.72,58.14 21.03,57.45 17.83,57.45 | 17.83,57.45 17.83,57.91 17.75,57.99 U$6.5 17.6,58.14 C25.2 | 17.83,57.45 17.83,55.17 17.07,54.41 17.07,54.18 C7.2 17.07,54.03 17.07,52.27 19.51,49.84 20.42,49.84 IC3.7 20.57,49.84 22.94,52.2 22.94,53.03 | 22.94,53.03 22.94,54.1 C5.2 | 22.94,53.03 28.35,53.03 28.96,53.65 28.96,54.1 C4.2 | R1.1 4.88,3.35 5.71,3.35 v7.01,4.65 8.15,5.79 9.98,5.79 C16.2 9.98,5.94 9.98,8 R18.1 10.06,8.15 11.96,8.15 C14.2 12.12,8.23 12.42,8.23 13.18,8.99 U$8.2 | 7.92,39.78 8.27,39.43 | 8.27,39.43 8.69,39.01 8.99,39.01 U$12.P2 | 7.92,39.78 7.92,42.98 R4.1 | 7.92,39.78 4.65,36.5 3.81,36.5 U$3.P5 | U$11.P2 23.47,62.03 23.47,62.41 v22.86,63.02 22.33,63.55 22.33,64.47 23.01,65.15 30.18,65.15 32.31,63.02 U$10.ANODE
  Top 0.305: 12.99,14.36 13.34,14.71 16.46,14.71 17.22,13.95 17.22,13.49 17.68,13.03 18.14,13.03 REG1.GND 17.6,12.95 17.22,12.57 17.22,12.04 16.61,11.43 15.09,11.43 14.4,12.12 14.02,12.12 C3.2 | 12.99,14.36 12.5,13.87 12.04,13.87 C2.1 | C24.2 29.03,58.14 30.56,58.14 30.63,58.06 U$5.5 30.71,57.91 30.71,56.62 31.66,55.66 | 31.66,55.66 32.69,54.63 32.69,54.1 U$2.5 | v6.02,58.29 6.93,58.29 LED1.C | v6.02,58.29 5.03,58.29 LED2.C | 6.02,62.26 6.93,62.26 LED3.C | 6.02,62.26 5.03,62.26 LED4.C | 6.02,62.26 v6.02,58.29 | C27.2 18.9,40.54 v19.74,41.38 20.5,42.14 IC3.1 | U$1.P35 14.94,32.16 13.56,33.53 12.65,33.53 C11.2 12.5,33.53 8.15,33.53 7.09,32.46 U$13.ANODE 6.93,32.31 6.93,31.55 5.33,29.95 JP1.15 | v28.12,12.12 28.19,12.19 28.19,13.11 C26.2 | v35.97,58.14 35.05,58.14 C22.2 | v18.9,26.9 18.14,26.14 U$1.P47 | v24.08,27.66 23.7,27.66 23.16,28.19 23.09,28.19 U$1.P8 | v21.72,36.12 20.95,35.36 U$1.P23 | v31.62,55.63 31.66,55.66 | v13.03,14.33 12.99,14.36 | v8.23,39.4 8.27,39.43 | 18.11,26.11 v17.38,25.38
  Top 0.406: U$1.P47 18.11,26.11 | v14,22 14.5,22 15.01,21.49
  Bottom 0.406: v17.38,25.38 v14,22
  pour Bottom: 0,0 38,0 38,66 0,66
LASER_PWM_IN
  Top 0.152: R16.2 22.94,21.87 19.81,21.87 16.38,25.3 13.41,25.3 13.11,25.6 13.11,26.06 15.62,28.57 U$1.P40
MISO  (via drill 0.3)
  Top 0.152: v25.76,30.33 25.76,31.7 24.16,33.3 23.93,33.3 23.47,32.84 U$1.P16 | v21.95,20.57 20.19,20.57 16.84,23.93 6.93,23.93 5.33,22.33 JP1.9
  Bottom 0.152: v25.76,30.33 25.22,29.79 25.22,24.77 25.68,24.31 25.68,23.85 22.4,20.57 v21.95,20.57
MOSI  (via drill 0.3)
  Top 0.152: v18.9,31.62 21.49,31.62 23.01,33.15 U$1.P17
  Bottom 0.152: v18.9,31.62 13.64,26.36 13.18,26.36 6.55,19.74 5.33,19.74 JP1.7
N$1
  Top 0.152: C3.1 14.02,13.87 15.77,13.87 REG1.BYPASS
N$2  (via drill 0.3)
  Top 0.152: v7.39,48.69 7.39,50.6 3.05,54.94 3.05,58.14 R2.2 | v13.72,40.08 14.02,40.08 18.44,35.66 U$1.P25
  Bottom 0.152: v7.39,48.69 13.72,42.37 v13.72,40.08
N$3
  Top 0.152: LED2.A 4.95,59.82 3.05,59.82 R2.1
N$4
  Top 0.152: D2.1 10.06,15.77 11.66,15.77 11.96,16.08 C1.1 12.04,16.08 16.08,16.08 18.14,14.02 REG1.INHIBIT 18.21,13.95 18.44,13.95 19.05,13.34 19.05,12.65 18.52,12.12 18.21,12.12 REG1.IN
N$5
  Top 0.152: R4.2 6.1,42.98 6.1,38.79 4.42,37.11 3.81,37.11 U$3.P4
N$6
  Top 0.152: R11.1 15.01,54.1 15.01,53.26 17.37,50.9 17.37,49.76 14.94,47.32 14.48,47.32 IC3.10
N$7
  Top 0.152: U$2.1 35.28,54.1 34.59,54.1 32.77,55.93 U$2.4 32.77,56.01 32.77,56.31 34.14,57.68 34.14,60.66 32.69,62.1 30.18,62.1 29.34,62.94 JP7.1 29.26,63.02 27.51,64.77 23.39,64.77 22.86,64.24 U$11.P6
N$8
  Top 0.152: R12.1 12.95,54.1 12.95,49.23 12.8,49.07 12.8,45.49 13.49,44.81 14.4,44.81 IC3.12
N$9
  Top 0.152: U$4.1 27.28,58.06 26.59,58.06 24.77,59.89 U$4.4 24.69,59.97 22.86,61.8 22.86,61.95 U$11.P1 22.78,62.03 21.87,62.94 19.28,62.94 JP8.1
N$10
  Top 0.152: R10.1 30.94,50.14 25.3,50.14 21.79,46.63 16.76,46.63 15.54,45.41 13.34,45.41 13.11,45.64 13.11,48.92 13.95,49.76 14.4,49.76 IC3.8
N$11
  Top 0.152: R9.1 32.99,50.22 32.31,50.22 31.55,50.98 23.47,50.98 21.11,48.62 20.57,48.62 IC3.6
N$12
  Top 0.152: LED1.A 7.01,59.82 8.99,59.82 R3.1
N$13  (via drill 0.3)
  Top 0.152: v11.35,43.97 11.35,46.86 9.07,49.15 9.07,58.14 R3.2 | v12.95,40.08 17.3,35.74 17.68,35.74 18.06,35.36 U$1.P26
  Bottom 0.152: v11.35,43.97 11.35,41.68 v12.95,40.08
N$14
  Top 0.152: L1.2 6.1,44.96 6.1,44.81 4.72,43.43 4.72,39.7 4.12,39.09 3.81,39.09 U$3.P1
N$15
  Top 0.152: U$9.ANODE 19.96,7.39 19.36,8 17.37,8 U$8.1 17.37,7.92 17.37,5.71 15.7,4.04 U$14.P$2
N$16
  Top 0.152: U$5.1 33.3,58.06 32.54,58.06 30.71,59.89 U$5.4 30.63,59.97 30.33,59.97 29.11,61.19 28.5,61.19 26.75,62.94 JP7.2 26.67,63.02 25.76,63.93 24.16,63.93 U$11.P4
N$17  (via drill 0.3)
  Top 0.152: v24.61,61.27 24.16,61.72 24.16,61.95 U$11.P3 | JP8.2 16.69,62.94 17.68,61.95 17.68,59.97 U$6.4 17.75,59.89 18.75,59.89 19.2,59.44 19.2,58.83 19.96,58.06 20.27,58.06 U$6.1
  Bottom 0.152: v24.61,61.27 20.57,61.27 19.89,60.58 18.67,60.58 16.76,62.48 16.76,62.94 JP8.2
N$18
  Top 0.152: LD1.P$3 33.76,19.96 33.76,11.81 27.05,5.11 27.05,3.43 Q1.4
N$19
  Top 0.152: 23.81,11.24 24.69,10.36 Q1.3 | 23.81,11.24 22.94,12.12 22.02,12.12 R14.2 | 23.81,11.24 26.52,13.95 26.52,14.55 27.96,16 27.96,17.14 R13.2
N$20
  Top 0.152: C8.2 20.04,13.87 21.95,13.87 R14.1 22.02,13.87 22.78,14.63 24,14.63 U1.4
N$21
  Top 0.152: R15.2 30.18,13.11 30.18,11.2 29.34,10.36 Q1.1
N$22
  Top 0.152: C8.1 20.04,12.19 20.65,12.19 21.57,13.11 23.7,13.11 25.38,14.78 25.38,16.46 25.91,16.99 25.91,17.3 U1.1 25.98,17.37 26.52,17.91 28.65,17.91 30.18,16.38 30.18,14.86 R15.1
N$23
  Top 0.152: 24.08,20.12 24.99,20.12 R25.2 25.07,20.19 26.98,20.19 C9.1 | 24.08,20.12 23.01,20.12 R16.1 | 24.08,20.12 24.08,17.37 U1.3
N$24
  Top 0.152: LED3.A 7.01,63.78 8.99,63.78 R20.1
N$25
  Top 0.152: C15.1 18.14,3.05 18.14,4.95 R17.1 18.21,5.03 18.44,5.03 20.04,6.63 20.73,6.63 20.88,6.78 20.88,7.92 18.9,9.91 17.37,9.91 U$8.3 17.3,9.91 16.23,10.97 11.73,10.97 10.67,9.91 10.06,9.91 R18.2
N$26
  Top 0.152: R19.2 8,9.83 8.61,9.83 9.37,9.07 12.65,9.07 13.49,9.91 14.63,9.91 U$8.4
N$27
  Top 0.152: LED4.A 4.95,63.78 3.05,63.78 R21.1
N$28  (via drill 0.3)
  Top 0.152: v12.88,42.44 11.89,43.43 11.89,58.37 9.07,61.19 9.07,62.1 R20.2 | v12.42,41.38 12.42,39.85 16.92,35.36 17.37,35.36 17.75,34.98 U$1.P27
  Bottom 0.152: v12.88,42.44 12.88,41.83 v12.42,41.38
N$29  (via drill 0.3)
  Top 0.152: v7.77,46.02 7.54,46.25 2.29,46.25 1.22,47.32 1.22,59.51 2.97,61.27 2.97,62.1 R21.2 | v8.91,44.88 8.91,44.58 11.89,41.6 11.89,39.93 16.76,35.05 16.92,35.05 17.37,34.59 U$1.P28
  Bottom 0.152: v8.91,44.88 v7.77,46.02
NRST  (via drill 0.3)
  Top 0.152: v15.7,40.08 17.14,38.63 20.42,38.63 26.29,32.77 26.29,28.57 24.84,27.13 23.62,27.13 22.94,27.81 22.78,27.81 U$1.P7
  Bottom 0.152: v15.7,40.08 15.16,39.55 12.72,39.55 5.49,46.79 5.49,50.83 3.5,52.81 3.05,52.81 JP2.4
SCK  (via drill 0.3)
  Top 0.152: v19.96,30.79 21.95,30.79 23.62,32.46 U$1.P15
  Bottom 0.152: v19.96,30.79 7.47,18.29 6.33,18.29 5.26,17.22 JP1.5
SCL  (via drill 0.3)
  Top 0.152: v20.04,27.58 20.42,27.96 21.79,27.96 22.17,27.58 22.33,27.58 U$1.P6
  Bottom 0.152: v20.04,27.58 19.89,27.43 17.07,27.43 6.1,16.46 5.94,16.46 5.64,16.15 4.88,16.15 4.57,16.46 4.5,16.46 2.74,14.71 JP1.4
SDA  (via drill 0.3)
  Top 0.152: v20.04,26.82 20.8,27.58 21.57,27.58 21.95,27.2 U$1.P5 | v9.37,18.97 5.94,18.97 5.18,18.21 3.73,18.21 2.74,17.22 JP1.6
  Bottom 0.152: v20.04,26.82 12.19,18.97 v9.37,18.97
SPI_CS  (via drill 0.3)
  Top 0.152: v21.26,32.16 21.34,32.16 22.71,33.53 U$1.P18
  Bottom 0.152: v21.26,32.16 21.26,27.28 18.52,24.54 18.21,24.54 8.31,14.63 5.33,14.63 JP1.3
SWCLK  (via drill 0.3)
  Top 0.152: v16.38,29.87 16.54,29.72 18.52,29.72 18.82,30.02 18.82,30.48 18.52,30.79 18.06,30.79 17.98,30.71 15.7,30.71 14.63,29.64 U$1.P37
  Bottom 0.152: v16.38,29.87 16.38,30.33 17.07,31.01 17.07,31.55 4.27,44.35 4.27,44.42 3.5,45.19 3.05,45.19 JP2.1
SWDIO
  Top 0.152: U$1.P34 15.32,32.46 15.47,32.46 15.93,32 16.08,32 19.28,35.2 19.28,35.43 15.47,39.24 15.32,39.24 9.22,45.34 9.22,48.54 8.91,48.84 8.31,48.84 7.62,48.16 5.11,48.16 3.05,50.22 JP2.3
USB_DM
  Top 0.152: U$1.P32 16,33.22 15.62,33.6 14.86,33.6 10.44,38.02 10.44,38.41 9.22,39.62 9.07,39.62 U$12.P1 8.99,39.7 8.99,43.28 8.46,43.81 5.56,43.81 5.41,43.66 5.41,39.4 4.42,38.41 3.81,38.41 U$3.P2
USB_DP
  Top 0.152: U$1.P33 15.62,32.84 15.16,33.3 14.71,33.3 9.68,38.33 9.07,38.33 U$12.P3 8.99,38.33 8.23,38.33 5.87,35.97 2.97,35.97 2.82,36.12 2.82,37.34 3.2,37.72 3.73,37.72 U$3.P3
VUSB  (via drill 0.3)
  Top 0.305: 35.05,61.95 35.05,62.41 35.59,62.94 U$10.CATHODE | 35.05,61.95 35.05,59.89 C22.1 35.2,59.89 36.58,58.52 36.58,57.84 35.97,57.23 35.2,57.23 34.37,56.39 34.37,55.55 34.9,55.02 35.28,55.02 U$2.2 | v18.67,59.21 17.07,59.21 16.46,59.82 15.01,59.82 C25.1 | v20.8,60.73 21.11,60.73 21.95,59.89 C23.1 21.72,59.97 20.8,59.05 20.34,59.05 U$6.2 | 26.36,60.58 26.36,59.51 26.82,59.05 27.28,59.05 U$4.2 | 26.36,60.58 26.36,60.73 23.55,63.55 23.55,63.93 U$11.P5 | 26.36,60.58 28.04,60.58 28.73,59.89 28.96,59.89 C24.1 29.11,59.82 30.1,58.83 v31.01,58.83 | v31.77,59.59 32.31,59.05 33.3,59.05 U$5.2 | v33.6,61.95 35.05,61.95 | U$12.P5 10.97,39.01 10.67,39.01 9.37,40.31 9.37,43.51 7.92,44.96 L1.1 | 2.67,33.22 4.57,33.22 6.93,35.59 U$13.CATHODE | 2.67,33.22 2.44,33.45 2.44,42.29 5.26,45.11 5.26,45.64 5.49,45.87 6.86,45.87 7.7,45.03 L1.1 | U$8.5 14.63,8 14.63,6.63 12.19,4.19 U$14.P$1 12.34,4.04 12.27,4.12 10.06,4.12 C16.1 9.91,4.04 7.09,4.04 5.49,2.44 4.19,2.44 3.96,2.67 3.96,7.01 6.02,9.07 6.86,9.07 6.93,9.14 | 6.93,9.14 6.93,13.87 9.98,16.92 9.98,18.21 D2.2 9.98,18.36 9.98,19.28 8.46,20.8 2.67,20.8 1.6,21.87 1.6,30.33 2.59,31.32 2.59,33.15 2.67,33.22 | 6.93,9.14 7.92,8.15 R19.1 | v8.69,48.31 8.69,45.87 7.92,45.11 L1.1
  Bottom 0.305: v33.6,61.95 31.85,60.2 31.85,59.66 v31.77,59.59 v31.01,58.83 30.94,58.9 27.96,58.9 26.21,60.66 20.88,60.66 v20.8,60.73 19.28,59.21 v18.67,59.21 18.59,59.13 18.59,58.22 v8.69,48.31
XBARDUAL_OUT  (via drill 0.3)
  Top 0.152: 34.21,43.13 34.98,43.13 R28.2 | 34.21,43.13 33.07,43.13 R27.1 | R10.2 31.01,51.89 32.99,51.89 R9.2 32.99,51.97 33.3,52.27 v33.3,52.88 | v34.37,52.88 34.98,52.27 34.98,51.89 C6.1 | v33.3,60.73 33.3,59.97 U$5.3 | v34.21,48.77 34.21,43.13
  Bottom 0.152: 34.21,52.88 v33.3,52.88 v33.3,60.73 | 34.21,52.88 v34.21,48.77 | 34.21,52.88 v34.37,52.88
XCOARSE_IN  (via drill 0.3)
  Top 0.152: v28.04,53.65 27.58,54.1 27.05,54.1 R5.1 | v24.84,50.44 24.16,50.44 21.03,47.32 20.57,47.32 IC3.5 | v18.29,30.25 18.14,30.4 16.08,30.4 15.01,29.34 U$1.P38
  Bottom 0.152: v28.04,53.65 v24.84,50.44 24.84,36.8 v18.29,30.25
XDUAL_OUT
  Top 0.152: R22.1 29.03,43.13 30.94,43.13 R23.2 31.01,43.2 31.01,43.43 32,44.42 32,47.78 33.83,49.61 33.83,53.49 | R6.2 25.07,55.85 26.98,55.85 R5.2 27.05,55.85 28.96,55.85 C4.1 29.03,55.78 31.32,53.49 33.83,53.49 | 33.83,53.49 35.97,53.49 36.2,53.72 36.2,55.32 35.59,55.93 35.36,55.93 U$2.3
XFINE_IN  (via drill 0.3)
  Top 0.152: v18.21,52.05 18.21,54.79 18.36,54.94 21.64,54.94 21.79,54.79 22.25,54.79 22.4,54.94 23.62,54.94 24.38,54.18 24.99,54.18 R6.1 | v16.84,50.67 16.84,50.52 14.94,48.62 14.48,48.62 IC3.9 | v15.16,41.38 15.16,39.85 15.47,39.55 15.62,39.55 19.58,35.59 19.58,35.05 16.23,31.7 16.08,31.7 13.79,29.41 13.79,29.26 14.55,28.5 14.71,28.5 15.09,28.88 15.24,28.88 U$1.P39
  Bottom 0.152: v18.21,52.05 v16.84,50.67 15.16,49 v15.16,41.38
YBARDUAL_OUT
  Top 0.152: R30.2 34.98,39.85 33.07,39.85 R29.1 32.38,39.85 30.33,41.91 26.98,41.91 23.85,45.03 22.55,45.03 21.64,44.12 16.31,44.12 16.15,44.27 15.7,44.27 15.54,44.12 13.34,44.12 12.19,45.26 12.19,55.02 12.95,55.78 R12.2 13.03,55.85 14.25,55.85 | 14.25,55.85 14.94,55.85 R11.2 C7.1 | 14.25,55.85 14.25,62.71 16.31,64.77 17.14,64.77 17.75,64.16 17.75,62.33 20.12,59.97 20.27,59.97 U$6.3
YCOARSE_IN  (via drill 0.3)
  Top 0.152: v19.58,50.67 20.95,52.05 20.95,54.1 R7.1 | v18.67,49.76 14.94,46.02 14.48,46.02 IC3.11 | v22.71,35.59 21.72,34.59 U$1.P21
  Bottom 0.152: v19.58,50.67 v18.67,49.76 18.75,49.76 22.71,45.8 v22.71,35.59
YDUAL_OUT  (via drill 0.3)
  Top 0.152: R26.2 30.94,39.85 29.03,39.85 R24.1 28.96,39.85 28.27,39.85 v23.62,44.5 | R8.2 19.05,55.85 20.95,55.85 R7.2 21.03,55.85 22.02,55.85 | 22.02,55.85 22.94,55.85 C5.1 23.01,55.85 23.77,56.62 27.13,56.62 28.19,57.68 28.19,59.36 27.66,59.89 27.36,59.89 U$4.3 | 22.02,55.85 v22.02,55.32
  Bottom 0.152: v23.62,44.5 23.62,53.72 v22.02,55.32
YFINE_IN  (via drill 0.3)
  Top 0.152: v18.97,51.28 18.97,54.1 R8.1 | v15.93,43.74 14.71,43.74 14.48,43.51 IC3.13 | v20.19,38.1 20.5,38.1 22.25,36.35 22.25,35.89 21.34,34.98 U$1.P22
  Bottom 0.152: v18.97,51.28 18.97,50.83 15.93,47.78 v15.93,43.74 20.19,39.47 v20.19,38.1

### Text on the board
Bottom: PeachyD v1.8 / Bottom Side